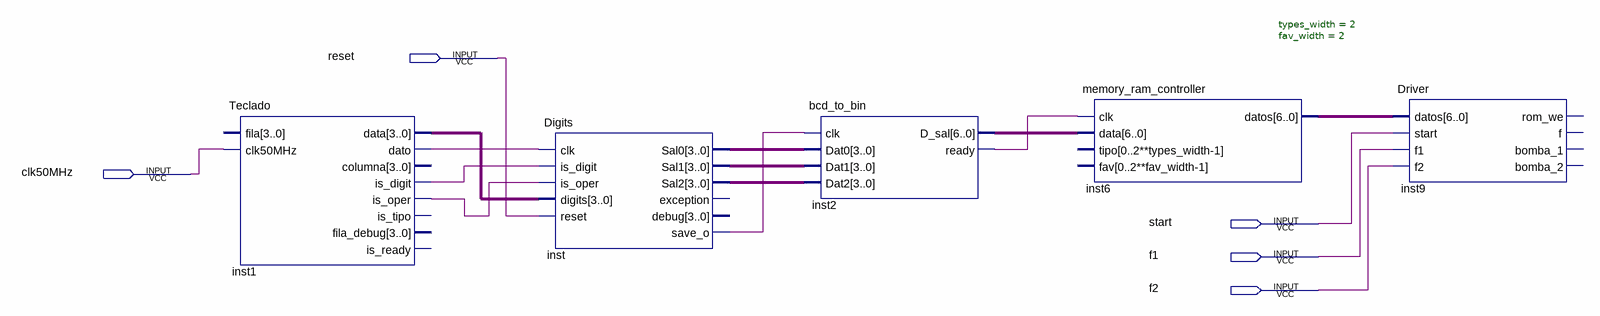
[diagram p0: schematic sheet]
// Quartus schematic diagrama.bdf as structural Verilog: 5 symbols, 5 pins
module diagrama (
  input  reset,
  input  clk50MHz,
  input  start,
  input  f1,
  input  f2
);

  wire inst1_dato, inst1_is_digit, inst1_is_oper, inst2_ready, inst_save_o;
  wire [3:0] inst1_data, inst_sal0, inst_sal1, inst_sal2;
  wire [6:0] inst2_d_sal, inst6_datos;

  Teclado inst1 (
    .clk50MHz(clk50MHz), .data(inst1_data), .dato(inst1_dato), .is_digit(inst1_is_digit),
    .is_oper(inst1_is_oper));  // open: fila, columna, is_tipo, fila_debug, is_ready
  Digits inst (
    .clk(inst1_dato), .is_digit(inst1_is_digit), .is_oper(inst1_is_oper), .digits(inst1_data), .reset(reset),
    .Sal0(inst_sal0), .Sal1(inst_sal1), .Sal2(inst_sal2), .save_o(inst_save_o));  // open: exception, debug
  bcd_to_bin inst2 (
    .clk(inst_save_o), .Dat0(inst_sal0), .Dat1(inst_sal1), .Dat2(inst_sal2), .D_sal(inst2_d_sal),
    .ready(inst2_ready));
  memory_ram_controller #(.types_width(2), .fav_width(2)) inst6 (
    .clk(inst2_ready), .data(inst2_d_sal), .datos(inst6_datos));  // open: tipo, fav
  Driver inst9 (.datos(inst6_datos), .start(start), .f1(f1), .f2(f2));  // open: rom_we, f, bomba_1, bomba_2
endmodule
